# Altium schematic sheet MFR-25FBF52-1K1_MFR-25FBF52-1K.schdoc
size 127 x 99 mm
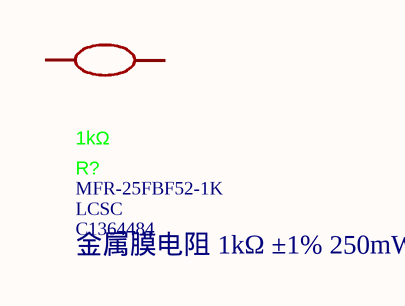
[diagram p0: MFR-25FBF52-1K1_MFR-25FBF52-1K.schdoc]

## Parts
R?  1kΩ  Supplier: LCSC  Supplier Part: C1364484  LCSC Part Name: 金属膜电阻 1kΩ ±1% 250mW  [RES-TH_BD2.4-L6.3-P10.30-D0.6]

## Nets

Not connected (* = marked no-connect by the designer): R? 1 2

## Library data of the parts
R? = MFR-25FBF52-1K: Manufacturer: YAGEO(国巨); Add into BOM: yes; Tolerance: ±1%; Power(Watts): 250mW; Temperature Coefficient: ±100ppm/℃; Symbol: MFR-25FBF52-1K; Device: MFR-25FBF52-1K; Manufacturer Part: MFR-25FBF52-1K; Supplier Footprint: 插件,D2.4xL6.3mm; JLCPCB Part Class: Extended Part; Datasheet: https://item.szlcsc.com/datasheet/MFR-25FBF52-1K/1454772.html; Convert to PCB: yes; Type: Metal Film Resistor; Value: 1kΩ; Operating Temperature: -55℃~+155℃